# Altium project Qaud FC V10.6.PrjPcb
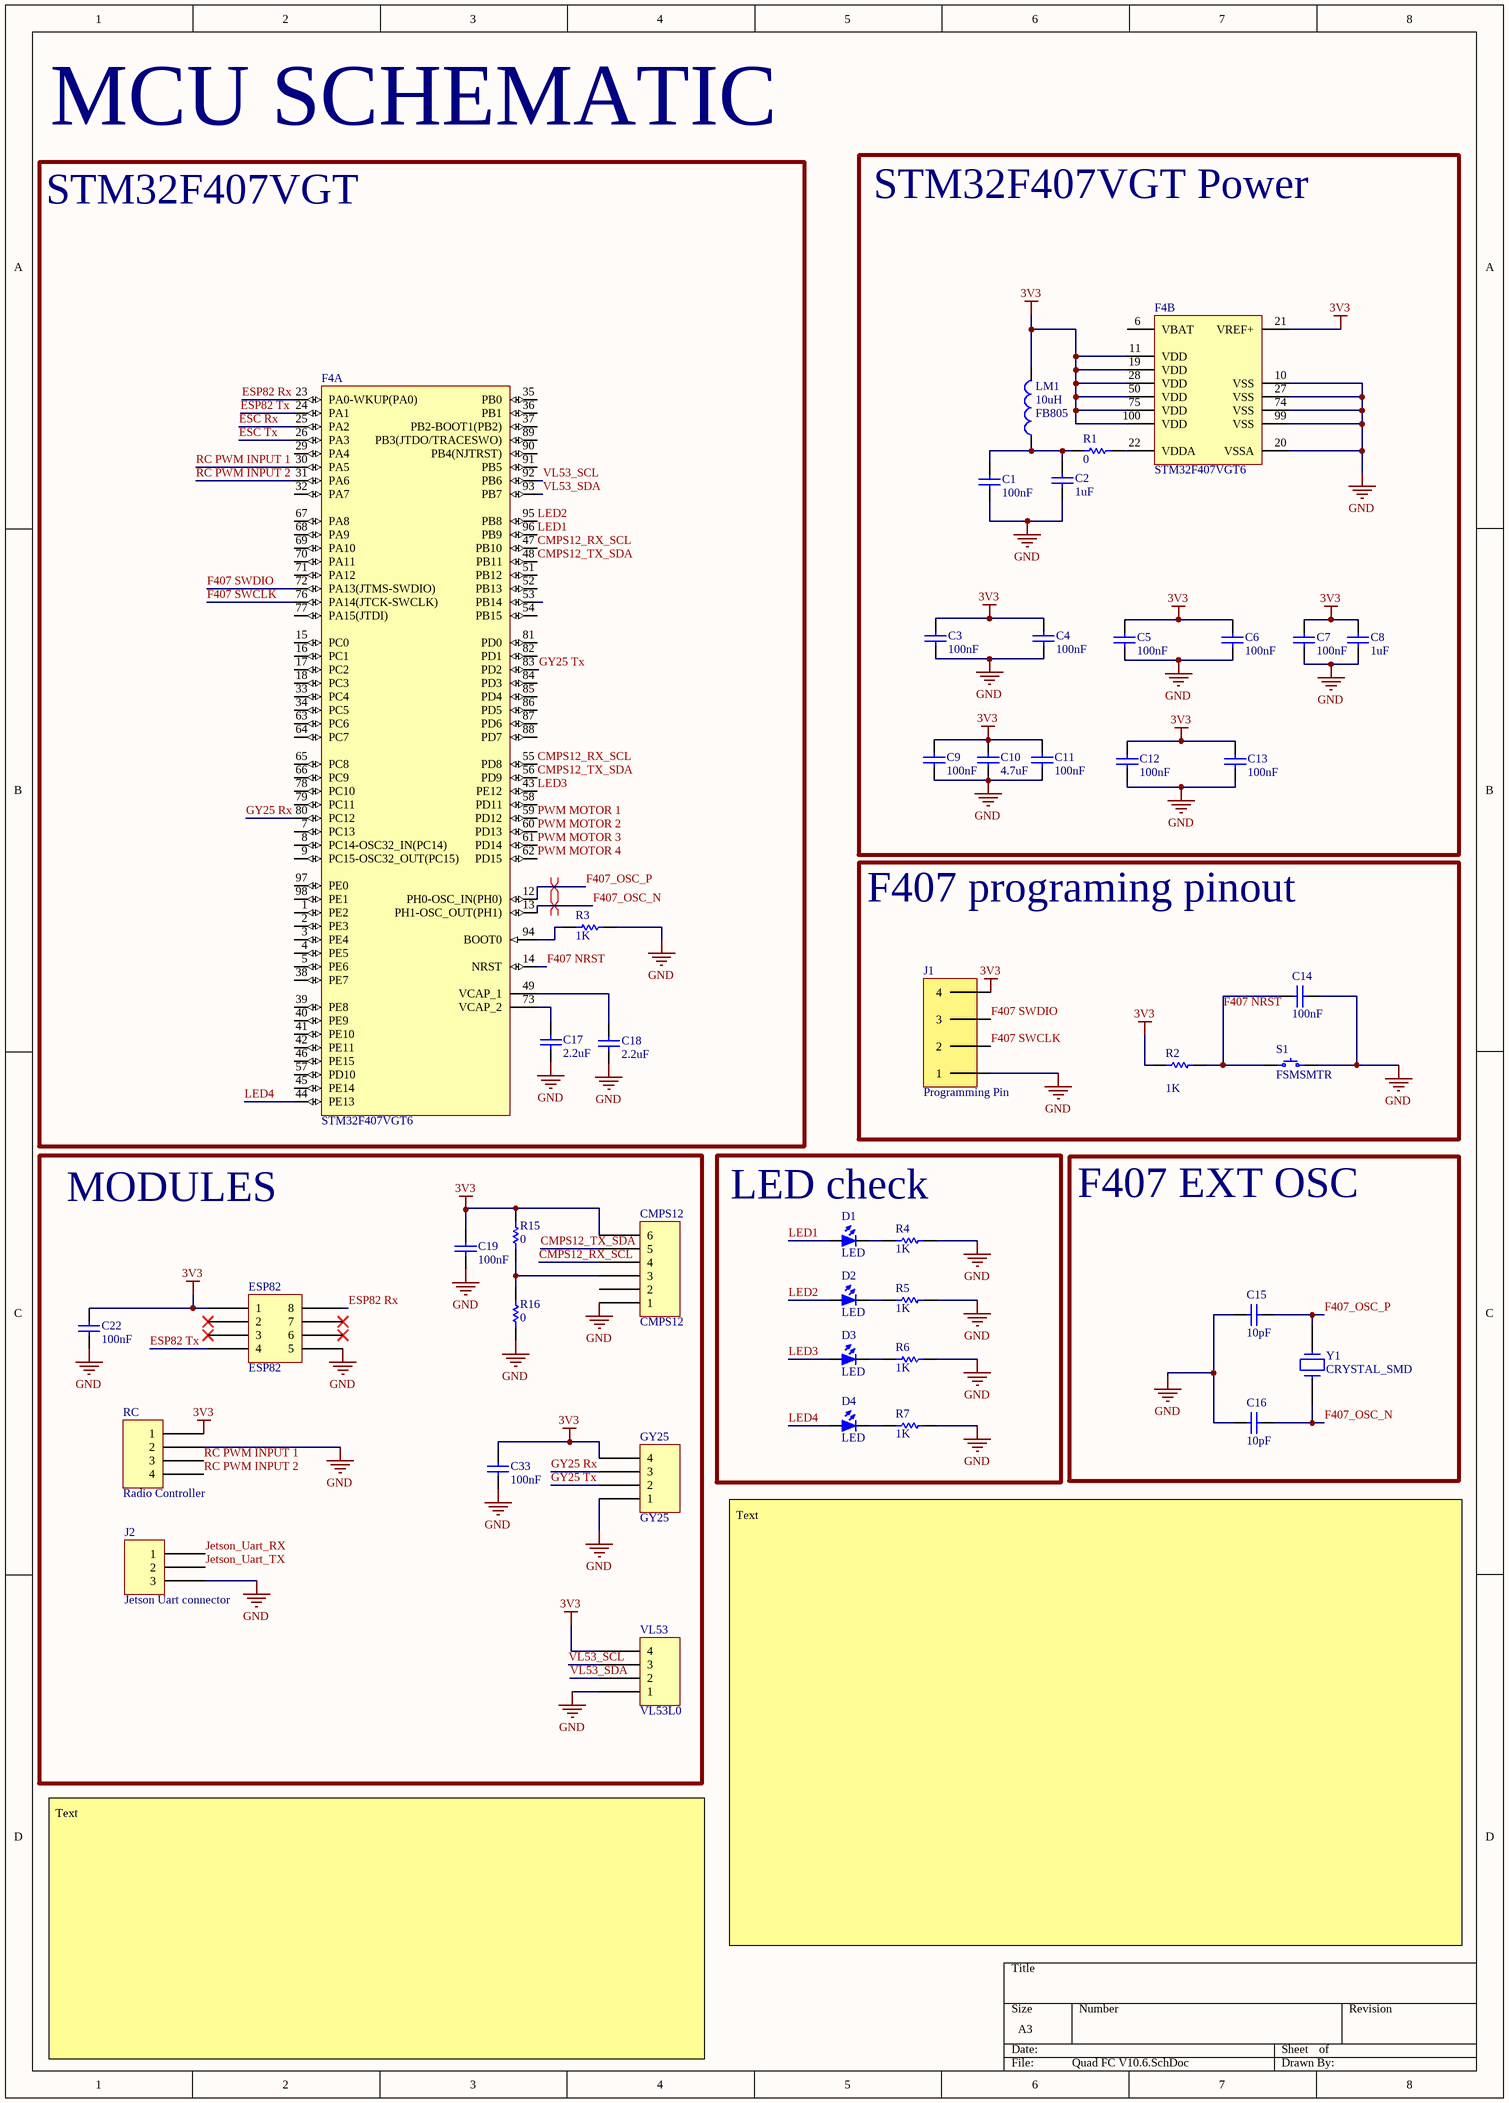
[diagram p0: Quad FC V10.6.SchDoc]
2 sheets, 70 parts. Net scope: global (net labels, ports and power ports of the same name join across sheets).
Board files: Quad FC 10.6.7.PcbDoc, Quad FC V10.6.5.PcbDoc
Sheets:
  Quad FC V10.6.SchDoc
  Quad FC power V10.6.SchDoc

## Sheet Quad FC V10.6.SchDoc
size A3 portrait; SheetNumber: 1; SheetTotal: 2

### Parts
C1  100nF  [CAP0603]
C2  1uF  [CAP0603]
C3  100nF  [CAP0603]
C4  100nF  [CAP0603]
C5  100nF  [CAP0603]
C6  100nF  [CAP0603]
C7  100nF  [CAP0603]
C8  1uF  [CAP0603]
C9  100nF  [CAP0603]
C10  4.7uF  [CAP0603]
C11  100nF  [CAP0603]
C12  100nF  [CAP0603]
C13  100nF  [CAP0603]
C14  100nF  [CAP0603]
C15  10pF  [CAP0603]
C16  10pF  [CAP0603]
C17  2.2uF  [CAP0603]
C18  2.2uF  [CAP0603]
C19  100nF  [CAP0603]
C22  100nF  [CAP0603]
C33  100nF  [CAP0603]
CMPS12  CMPS12  [SAMTEC SSW-106-03-T-S]
D1  LED  [0603 - LED]
D2  LED  [0603 - LED]
D3  LED  [0603 - LED]
D4  LED  [0603 - LED]
ESP82  ESP82  [HARWIN M20-7830445]
F4  STM32F407VGT6  [STM-LQFP100_N]  (parts A,B of 2)
GY25  GY25  [SAMTEC SSW-104-03-T-S]
J1  Programming Pin  [HEADER 4X1]
J2  Jetson Uart connector  [JST XH B3B-XH-A]
LM1  10uH  value FB805  [0805L]
R1  0  [RES0603]
R2  1K  [RES0603]
R3  1K  [RES0603]
R4  1K  [RES0603]
R5  1K  [RES0603]
R6  1K  [RES0603]
R7  1K  [RES0603]
R15  0  [RES0603]
R16  0  [RES0603]
RC  Radio Controller  [JST SM04B-GHS-TB]
S1  FSMSMTR  [TE FSMSMTR]
VL53  VL53L0  [JST SM04B-GHS-TB]
Y1  CRYSTAL_SMD  [My_Crystal - SMD]

### Blocks framed on the sheet
MCU SCHEMATIC: C17 C18 F4 R3
STM32F407VGT Power: C1-C13 F4 LM1 R1
F407 programing pinout: C14 J1 R2 S1
MODULES: C19 C22 C33 CMPS12 ESP82 GY25 J2 R15 R16 RC VL53
LED check: D1-D4 R4-R7
F407 EXT OSC: C15 C16 Y1

### Nets
3V3: C3.2 C4.2 C5.2 C6.2 C7.1 C8.1 C9.2 C10.2 C11.2 C12.2 C13.2 C19.1 C22.1 C33.1 CMPS12.6 ESP82.1 F4.11(VDD) F4.19(VDD) F4.21(VREF+) F4.28(VDD) F4.50(VDD) F4.75(VDD) F4.100(VDD) GY25.4 J1.4 LM1.2 R2.1 R15.2 RC.1 VL53.4
GND: C1.1 C2.1 C3.1 C4.1 C5.1 C6.1 C7.2 C8.2 C9.1 C10.1 C11.1 C12.1 C13.1 C14.2 C15.1 C16.2 C17.2 C18.2 C19.2 C22.2 C33.2 CMPS12.1 ESP82.5 F4.10(VSS) F4.20(VSSA) F4.27(VSS) F4.74(VSS) F4.99(VSS) GY25.1 J1.1 J2.3 R3.2 R4.2 R5.2 R6.2 R7.2 R16.1 RC.2 S1.2 VL53.1
CMPS12_RX_SCL: CMPS12.4 F4.47(PB10) F4.55(PD8)
CMPS12_TX_SDA: CMPS12.5 F4.48(PB11) F4.56(PD9)
ESC Rx: F4.25(PA2)
ESC Tx: F4.26(PA3)
ESP82 Rx: ESP82.8 F4.23(PA0-WKUP(PA0))
ESP82 Tx: ESP82.4 F4.24(PA1)
F407 NRST: C14.1 F4.14(NRST) R2.2 S1.1
F407 SWCLK: F4.76(PA14(JTCK-SWCLK)) J1.2
F407 SWDIO: F4.72(PA13(JTMS-SWDIO)) J1.3
F407_OSC_N: C16.1 F4.13(PH1-OSC_OUT(PH1)) Y1.1
F407_OSC_P: C15.2 F4.12(PH0-OSC_IN(PH0)) Y1.2
GY25 Rx: F4.80(PC12) GY25.3
GY25 Tx: F4.83(PD2) GY25.2
Jetson_Uart_RX: J2.1
Jetson_Uart_TX: J2.2
LED1: D1.1(A) F4.96(PB9)
LED2: D2.1(A) F4.95(PB8)
LED3: D3.1(A) F4.43(PE12)
LED4: D4.1(A) F4.44(PE13)
PWM MOTOR 1: F4.59(PD12)
PWM MOTOR 2: F4.60(PD13)
PWM MOTOR 3: F4.61(PD14)
PWM MOTOR 4: F4.62(PD15)
RC PWM INPUT 1: F4.30(PA5) RC.3
RC PWM INPUT 2: F4.31(PA6) RC.4
VL53_SCL: F4.92(PB6) VL53.3
VL53_SDA: F4.93(PB7) VL53.2
NetC1_2: C1.2 C2.2 LM1.1 R1.1
NetC17_1: C17.1 F4.73(VCAP_2)
NetC18_1: C18.1 F4.49(VCAP_1)
NetCMPS12_3: CMPS12.3 R15.1 R16.2
NetD1_2: D1.2(K) R4.1
NetD2_2: D2.2(K) R5.1
NetD3_2: D3.2(K) R6.1
NetD4_2: D4.2(K) R7.1
NetF4_22: F4.22(VDDA) R1.2
NetF4_94: F4.94(BOOT0) R3.1

Not connected (* = marked no-connect by the designer): CMPS12 2; ESP82 2* 3* 6* 7*; F4 1(PE2) 2(PE3) 3(PE4) 4(PE5) 5(PE6) 6(VBAT) 7(PC13) 8(PC14-OSC32_IN(PC14)) 9(PC15-OSC32_OUT(PC15)) 15(PC0) 16(PC1) 17(PC2) 18(PC3) 29(PA4) 32(PA7) 33(PC4) 34(PC5) 35(PB0) 36(PB1) 37(PB2-BOOT1(PB2)) 38(PE7) 39(PE8) 40(PE9) 41(PE10) 42(PE11) 45(PE14) 46(PE15) 51(PB12) 52(PB13) 53(PB14) 54(PB15) 57(PD10) 58(PD11) 63(PC6) 64(PC7) 65(PC8) 66(PC9) 67(PA8) 68(PA9) 69(PA10) 70(PA11) 71(PA12) 77(PA15(JTDI)) 78(PC10) 79(PC11) 81(PD0) 82(PD1) 84(PD3) 85(PD4) 86(PD5) 87(PD6) 88(PD7) 89(PB3(JTDO/TRACESWO)) 90(PB4(NJTRST)) 91(PB5) 97(PE0) 98(PE1)

### Layout directives
differential pair: F407_OSC_N, F407_OSC_P

### Notes on the sheet
- STM32F407VGT
- Text

### Library data of the parts
C1-C19 C22 C33 = CAP SMD PACKAGE: F407VET6 Power CAP; Designer: Abbas Basereh; Desc.: CAP SMD TOTAL PACKAGES; Data: 2017-3-10
CMPS12 = SSW-106-03-T-S: CONN RCPT 6POS 0.1 TIN PCB; Manufacturer: Samtec Inc.; Connector Type: Receptacle; Contact Length - Post: 0.394" (10.00mm); Current Rating (Amps): 5.7A per Contact; Material Flammability Rating: UL94 V-0; Number of Positions: 6; Number of Positions Loaded: All; Pitch - Mating: 0.100" (2.54mm); Style: Board to Board or Cable; Part Number: SSW-106-03-T-S; ComponentLink1Description: Datasheet; ComponentLink1URL: http://suddendocs.samtec.com/prints/ssw-s.pdf; ComponentLink2Description: DigiKey Link; ComponentLink2URL: https://www.digikey.com/en/products/detail/samtec-inc/SSW-106-03-T-S/1790202; Contact Finish - Mating: Tin; Contact Finish - Post: Tin; Contact Type: Forked; Fastening Type: Push-Pull; Insulation Color: Black; Insulation Height: 0.335" (8.51mm); LastUpdated: 6/21/2022 3:09:22 PM; Lifecycle Status: Active; Minimum Order: 1; Mounting Type: Through Hole; Number of Rows: 1; Operating Temperature: -55°C ~ 105°C; Packaging: Bulk; Part Status: Active; Price: 0.55; Series: SSW; Supplier 1: DigiKey; Supplier Part Number 1: SAM8865-ND; Termination: Solder
ESP82 = M20-7830442: CONN RCPT 8POS 0.1 GOLD PCB; Manufacturer: Harwin Inc.; Connector Type: Receptacle; Contact Length - Post: 0.118" (3.00mm); Current Rating (Amps): 3A; Mated Stacking Heights: 11.04mm, 12.63mm; Material Flammability Rating: UL94 V-0; Number of Positions: 8; Number of Positions Loaded: All; Pitch - Mating: 0.100" (2.54mm); Style: Board to Board or Cable; Part Number: M20-7830442; ComponentLink1Description: Datasheet; ComponentLink1URL: https://cdn.harwin.com/pdfs/C001XX_M20_Series_Connectors.pdf; ComponentLink2Description: DigiKey Link; ComponentLink2URL: http://digikey.com/product-detail/en/harwin-inc/M20-7830442/952-1789-ND/3727758; Contact Finish - Mating: Gold; Contact Finish - Post: Tin; Contact Finish Thickness - Mating: Flash; Contact Type: Female Socket; Fastening Type: Push-Pull; Insulation Color: Black; Insulation Height: 0.335" (8.51mm); LastUpdated: 9/21/2022 7:04:26 PM; Lifecycle Status: Active; Minimum Order: 1; Mounting Type: Through Hole; Number of Rows: 2; Operating Temperature: -40°C ~ 105°C; Packaging: Tube; Part Status: Active; Price: 1.36; Row Spacing - Mating: 0.100" (2.54mm); Series: M20; Supplier 1: DigiKey; Supplier Part Number 1: 952-1789-ND; Termination: Solder
F4 = STM32F407VGT6: ARM Cortex-M4 32-bit MCU+FPU, 210 DMIPS, 1024 kB Flash, 192 kB Internal RAM, 82 I/Os, 100-pin LQFP, -40 to 85 degC, Tray; Manufacturer: STMicroelectronics; D/A Converter: 2x12-bit; FLASH Size (Prog) (kB): 1024; I/Os (High Current): 82; Internal RAM Size (kB): 192; Operating Frequency(F) (Processor speed) (MHz): 168; Supply Voltage(Vcc) max (V): 3.6; Supply Voltage(Vcc) min (V): 1.8; DatasheetVersion: Rev. 4; PackageVersion: Rev. 1, 06/2013; PackageReference: LQFP100; PackageDescription: 100-Pin Low Profile Quad Flat Package, 14 x 14 mm Body, 0.5 mm Pitch; Supplier 1: Digi-Key; Supplier Part Number 1: 497-11605-ND; Supplier 2: Farnell; Supplier Part Number 2: 2064368; Supplier 3: Newark; Supplier Part Number 3: 73T2333; Supplier 4: Mouser; Supplier Part Number 4: 511-STM32F407VGT6; Core: ARM Cortex-M4; Packing: Tray; Mounting Technology: Surface Mount; PartNumber: STM32F407VGT6; ComponentLink1Description: Manufacturer URL; ComponentLink1URL: http://www.st.com/web/en/home.html; ComponentLink2Description: Datasheet; ComponentLink2URL: http://www.st.com/st-web-ui/static/active/en/resource/technical/document/datasheet/DM00037051.pdf; ComponentLink3Description: Package Specification; ComponentLink3URL: http://www.st.com/st-web-ui/static/active/en/resource/technical/document/data_brief/DM00071938.pdf
GY25 = SSW-104-03-T-S: CONN RCPT 4POS 0.1 TIN PCB; Manufacturer: Samtec Inc.; Connector Type: Receptacle; Current Rating (Amps): 5.7A per Contact; Material Flammability Rating: UL94 V-0; Number of Positions: 4; Number of Positions Loaded: All; Style: Board to Board or Cable; Part Number: SSW-104-03-T-S; ComponentLink2Description: DigiKey Link; ComponentLink2URL: http://digikey.com/product-detail/en/samtec-inc/SSW-104-03-T-S/SSW-104-03-T-S-ND/7874034; Contact Finish - Mating: Tin; Contact Finish - Post: Tin; Contact Type: Forked; Fastening Type: Push-Pull; Insulation Color: Black; LastUpdated: 6/21/2022 3:08:52 PM; Lifecycle Status: Active; Minimum Order: 1; Mounting Type: Through Hole; Number of Rows: 1; Operating Temperature: -55°C ~ 105°C; Packaging: Bulk; Part Status: Active; Price: 0.83; Series: SSW; Supplier 1: DigiKey; Supplier Part Number 1: SSW-104-03-T-S-ND; Termination: Solder
J1 = Header4X1
J2 = B3B-XH-A(LF)(SN): CONN HEADER VERT 3POS 2.5MM; Manufacturer: JST Sales America Inc.; Contact Length - Post: 0.134" (3.40mm); Current Rating (Amps): 3A; Material Flammability Rating: UL94 V-0; Number of Positions: 3; Number of Positions Loaded: All; Pitch - Mating: 0.098" (2.50mm); Shrouding: Shrouded - 4 Wall; Style: Board to Cable/Wire; Voltage Rating: 250V; Part Number: B3B-XH-A(LF)(SN); ComponentLink1Description: Datasheet; ComponentLink1URL: http://www.jst-mfg.com/product/pdf/eng/eXH.pdf; ComponentLink2Description: DigiKey Link; ComponentLink2URL: http://digikey.com/product-detail/en/jst-sales-america-inc/B3B-XH-A-LF-SN/455-2248-ND/1651046; Connector Type: Header; Contact Finish - Mating: Tin; Contact Finish - Post: Tin; Contact Material: Brass; Contact Shape: Square; Contact Type: Male Pin; Fastening Type: Detent Lock; Insulation Color: Natural; Insulation Height: 0.276" (7.00mm); Insulation Material: Polyamide (PA66), Nylon 6/6; LastUpdated: 1/12/2020 11:46:22 PM; Lifecycle Status: Active; Minimum Order: 1; Mounting Type: Through Hole; Number of Rows: 1; Operating Temperature: -25°C ~ 85°C; Packaging: Bulk; PartId: 68; Part Status: Active; Price: 0.19; Series: XH; Supplier 1: DigiKey; Supplier Part Number 1: 455-2248-ND; Termination: Press-Fit, Solder
LM1 = L SMA 0.25W: Inductor; Code_IEC: 1005; Published: 8-Jun-2000; LatestRevisionDate: 29-May-2009; LatestRevisionNote: IPC-7351 Footprint Added.; PackageReference: 0402-A; Publisher: Altium Limited; PackageDescription: Chip Inductor; Code_JEITA: 0402
R1-R7 R15 R16 = RES SMD PACKAGE: TOTAL SMD RESISTOR PACK; Designer: Abbas Basereh; Desc.: RES SMD PAKAGES; Data: 2017-3-10
  R1 R15 R16: VALUE: 0
  R2-R7: VALUE: 1K
RC VL53 = SM04B-GHS-TB(LF)(SN)-: CONN HEADER SMD R/A 4POS 1.25MM; Manufacturer: JST Sales America Inc.; Current Rating (Amps): 1A; Material Flammability Rating: UL94 V-0; Number of Positions: 4; Number of Positions Loaded: All; Pitch - Mating: 0.049" (1.25mm); Shrouding: Shrouded - 4 Wall; Style: Board to Cable/Wire; Voltage Rating: 50V; Part Number: SM04B-GHS-TB(LF)(SN)-; ComponentLink1Description: Datasheet; ComponentLink1URL: http://www.jst-mfg.com/product/pdf/eng/eGH.pdf; ComponentLink2Description: DigiKey Link; ComponentLink2URL: http://digikey.com/product-detail/en/jst-sales-america-inc/SM04B-GHS-TB-LF-SN/455-1566-1-ND/807834; Connector Type: Header; Contact Finish - Mating: Tin; Contact Finish - Post: Tin; Contact Material: Phosphor Bronze; Contact Shape: Rectangular; Contact Type: Outer Shroud Contact; Fastening Type: Locking Ramp; Features: Solder Retention; Insulation Color: Natural; Insulation Height: 0.167" (4.25mm); Insulation Material: Polyamide (PA9T), Nylon 9T; LastUpdated: 1/12/2020 11:37:43 PM; Lifecycle Status: Active; Minimum Order: 1; Mounting Type: Surface Mount, Right Angle; Number of Rows: 1; Operating Temperature: -25°C ~ 85°C; Packaging: TapeAndReel; PartId: 55; Part Status: Active; Price: 0.21; Series: GH; Supplier 1: DigiKey; Supplier Part Number 1: 455-1566-1-ND; Termination: Solder
S1 = FSMSMTR: SWITCH TACTILE SPST-NO 0.05A 24V; Manufacturer: TE Connectivity ALCOSWITCH Switches; Actuator Height off PCB, Vertical: 4.57mm; Actuator Orientation: Top Actuated; Actuator Type: Standard; Contact Rating @ Voltage: 0.05A @ 24VDC; Illumination: Non-Illuminated; Operating Force: 180gf; Outline: 6.00mm x 3.50mm; Switch Function: Off-Mom; Part Number: FSMSMTR; Circuit: SPST-NO; ComponentLink1Description: Datasheet; ComponentLink1URL: https://www.te.com/commerce/DocumentDelivery/DDEController?Action=srchrtrv&DocNm=1437566-3&DocType=Customer+Drawing&DocLang=English; ComponentLink2Description: DigiKey Link; ComponentLink2URL: https://www.digikey.com/en/products/detail/te-connectivity-alcoswitch-switches/FSMSMTR/529671; LastUpdated: 2/8/2024 9:49:52 PM; Lifecycle Status: Active; Minimum Order: 1; Mounting Type: Surface Mount; Operating Temperature: -35°C ~ 85°C; Packaging: TapeAndReel; Part Status: Active; Price: 0.20; Series: FSMSM; Supplier 1: DigiKey; Supplier Part Number 1: 450-1758-1-ND; Termination Style: Gull Wing
Y1 = CRYSTAL_SMD: Crystal
D1-D4 = LED: Published: 8-Jun-2000; LatestRevisionDate: 08-Jul-2005; LatestRevisionNote: Mech Layer 1 removed.; PackageReference: LED-0; Publisher: Altium Limited

## Sheet Quad FC power V10.6.SchDoc
size A4; SheetNumber: 2; SheetTotal: 2
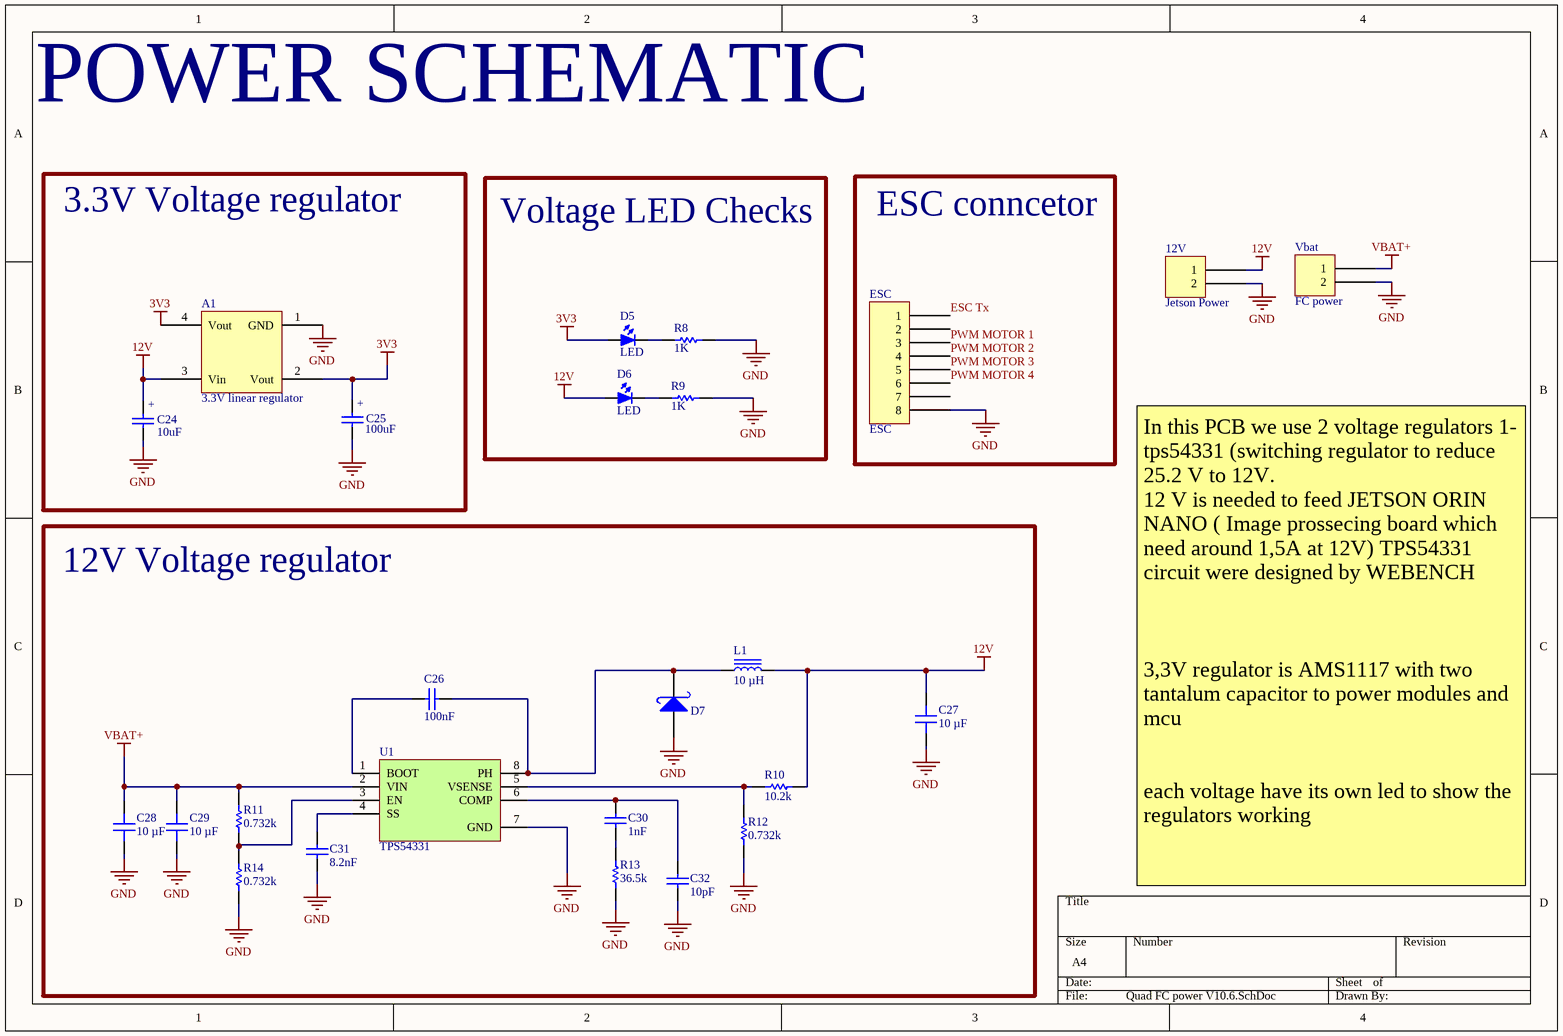
[diagram p1: Quad FC power V10.6.SchDoc]

### Parts
12V  Jetson Power  [JST XH B2B-XH-A]
A1  3.3V linear regulator  [SOT230P700X180-4N]
C24  10uF  [MY_CAP_SMD-B]
C25  100uF  [MY_CAP_SMD-B]
C26  100nF  [CAP0603]
C27  10 µF  [CAP 0805_2012]
C28  10 µF  [CAP 0805_2012]
C29  10 µF  [CAP 0805_2012]
C30  1nF  [CAP0603]
C31  8.2nF  [CAP0603]
C32  10pF  [CAP0603]
D5  LED  [0603 - LED]
D6  LED  [0603 - LED]
D7  1n5822  [DIOM4226X244N]  (value not drawn)
ESC  ESC  [JST BM08B-SRSS-TB]
L1  10 µH  [TAIYO YUDEN NRS8030]
R8  1K  [RES0603]
R9  1K  [RES0603]
R10  10.2k  [RES0603]
R11  0.732k  [RES0603]
R12  0.732k  [RES0603]
R13  36.5K  [RES0603]
R14  0.732k  [RES0603]
U1  TPS54331  [SO8]
Vbat  FC power  [JST XH B2B-XH-A]

### Blocks framed on the sheet
3.3V Voltage regulator: A1 C24 C25
Voltage LED Checks: D5 D6 R8 R9
ESC conncetor: ESC
12V Voltage regulator: C26-C32 D7 L1 R10-R14 U1

### Nets
3V3: A1.2(Vout) A1.4(Vout) C25.+ D5.1(A)
12V: 12V.1 A1.3(Vin) C24.+ C27.2 D6.1(A) L1.2 R10.2
GND: 12V.2 A1.1(GND) C24.- C25.- C27.1 C28.1 C29.1 C31.2 C32.2 D7.1(A) ESC.8 R8.2 R9.2 R12.1 R13.1 R14.1 U1.7(GND) Vbat.2
VBAT+: C28.2 C29.2 R11.2 U1.2(VIN) Vbat.1
ESC Tx: ESC.1
PWM MOTOR 1: ESC.3
PWM MOTOR 2: ESC.4
PWM MOTOR 3: ESC.5
PWM MOTOR 4: ESC.6
NetC26_1: C26.1 D7.2(K) L1.1 U1.8(PH)
NetC26_2: C26.2 U1.1(BOOT)
NetC30_1: C30.1 C32.1 U1.6(COMP)
NetC30_2: C30.2 R13.2
NetC31_1: C31.1 U1.4(SS)
NetD5_2: D5.2(K) R8.1
NetD6_2: D6.2(K) R9.1
NetR10_1: R10.1 R12.2 U1.5(VSENSE)
NetR11_1: R11.1 R14.2 U1.3(EN)

Not connected (* = marked no-connect by the designer): ESC 2 7

### Notes on the sheet
- POWER SCHEMATIC
- In this PCB we use 2 voltage regulators 1- tps54331 (switching regulator to reduce 25.2 V to 12V.
  12 V is needed to feed JETSON ORIN NANO ( Image prossecing board which need around 1,5A at 12V) TPS54331 circuit were designed by WEBENCH
  3,3V regulator is AMS1117 with two tantalum capacitor to power modules and mcu
  each voltage have its own led to show the regulators working

### Library data of the parts
12V Vbat = B2B-XH-A(LF)(SN): CONN HEADER VERT 2POS 2.5MM; Manufacturer: JST Sales America Inc.; Contact Length - Post: 0.134" (3.40mm); Current Rating (Amps): 3A; Material Flammability Rating: UL94 V-0; Number of Positions: 2; Number of Positions Loaded: All; Pitch - Mating: 0.098" (2.50mm); Shrouding: Shrouded - 4 Wall; Style: Board to Cable/Wire; Voltage Rating: 250V; Part Number: B2B-XH-A(LF)(SN); ComponentLink1Description: Datasheet; ComponentLink1URL: http://www.jst-mfg.com/product/pdf/eng/eXH.pdf; ComponentLink2Description: DigiKey Link; ComponentLink2URL: http://digikey.com/product-detail/en/jst-sales-america-inc/B2B-XH-A-LF-SN/455-2247-ND/1651045; Connector Type: Header; Contact Finish - Mating: Tin; Contact Finish - Post: Tin; Contact Material: Brass; Contact Shape: Square; Contact Type: Male Pin; Fastening Type: Detent Lock; Insulation Color: Natural; Insulation Height: 0.276" (7.00mm); Insulation Material: Polyamide (PA66), Nylon 6/6; LastUpdated: 1/12/2020 11:46:08 PM; Lifecycle Status: Active; Minimum Order: 1; Mounting Type: Through Hole; Number of Rows: 1; Operating Temperature: -25°C ~ 85°C; Packaging: Bulk; PartId: 67; Part Status: Active; Price: 0.15; Series: XH; Supplier 1: DigiKey; Supplier Part Number 1: 455-2247-ND; Termination: Press-Fit, Solder
A1 = ams1117
C24 C25 = CAP_TANTAL_B: 3.5X2.8MM; Value: 3300u
C26 C30-C32 = CAP SMD PACKAGE: as C1 on sheet Quad FC V10.6; Data: 2017-3-10
C27-C29 = GRM21BR61H106KE43K: CAP CER 10UF 50V X5R 0805; manufacturer: Murata Electronics; Tolerance: ±10%; Part Number: GRM21BR61H106KE43K; Value: 10 µF; Applications: General Purpose; Capacitance: 10 µF; componentlink1description: Datasheet; componentlink1url: https://search.murata.co.jp/Ceramy/image/img/A01X/G101/ENG/GRM21BR61H106KE43-01A.pdf; componentlink2description: DigiKey Link; componentlink2url: https://www.digikey.com/en/products/detail/murata-electronics/GRM21BR61H106KE43K/15191954; Device Package: 0805 (2012 Metric); lastupdated: 2/9/2024 8:15:01 PM; Lifecycle Status: Active; Minimum Order: 1; Mounting Type: Surface Mount, MLCC; Operating Temperature: -55°C ~ 85°C; Package / Case: 0805 (2012 Metric); packaging: TapeAndReel; partid: 40508; Part Status: Active; price: 0.05; series: GRM; Size / Dimension: 0.079" L x 0.049" W (2.00mm x 1.25mm); Supplier 1: DigiKey; Supplier Part Number 1: 490-GRM21BR61H106KE43KCT-ND; Temperature Coefficient: X5R; Thickness (Max): 0.057" (1.45mm); Voltage - Rated: 50V
D7 = 1n5822 SMD: Schottky Rectifiers; Part. No: SS34; Manufacturer: ON Semiconductor/Fairchild; Designer: Abbas Basereh; Link: https://www.aliexpress.com/item/Free-shipping-100pcs-1n5822-sma-smd-do-214ac-Schottky-diode-ss34/32337482329.html?spm=2114.01010208.3.1.zLZDsP&ws_ab_test=searchweb0_0,searchweb201602_4_10065_10068_10084_10083_10080_10082_10081_10060_10061_10062_10056_10055_10054_10059_10099_10078_10079_427_10073_10103_10102_10096_10052_10050_10051,searchweb201603_4&btsid=6e50dc92-ac69-45bc-a19e-209af19ce602; Link: http://www.tme.eu/en/details/ss34/smd-schottky-diodes/vishay/ss34-e357t/; Link: http://www.digikey.com/product-detail/en/on-semiconductor-fairchild/SS34/SS34FSCT-ND/2094459; Data: 16-12-2016
ESC = BM08B-SRSS-TBT(LF)(SN): CONN HEADER SMD 8POS 1MM; Part Number: BM08B-SRSS-TBT(LF)(SN)
L1 = NRS8030T100MJGJV: FIXED IND 10UH 3A 42.9 MOHM SMD; Manufacturer: Taiyo Yuden; Current - Saturation: 2.4A; DC Resistance (DCR): 42.9mOhm Max; Frequency - Self Resonant: 27MHz; Inductance Frequency - Test: 100 kHz; Material - Core: Ferrite; Shielding: Shielded; Tolerance: ±20%; Type: Drum Core, Wirewound; Part Number: NRS8030T100MJGJV; ComponentLink1Description: Datasheet; ComponentLink1URL: https://ds.yuden.co.jp/TYCOMPAS/ut/detail?pn=NRS8030T100MJGJV  &u=M; ComponentLink2Description: DigiKey Link; ComponentLink2URL: https://www.digikey.com/en/products/detail/taiyo-yuden/NRS8030T100MJGJV/4693986; Current Rating (Amps): 3 A; Device Package: Nonstandard; Height - Seated (Max): 0.118" (3.00mm); Inductance: 10 µH; LastUpdated: 2/8/2024 9:55:48 PM; Lifecycle Status: Active; Minimum Order: 1; Mounting Type: Surface Mount; Operating Temperature: -40°C ~ 125°C; Package / Case: Nonstandard; Packaging: TapeAndReel; PartId: 5482; Part Status: Active; Price: 0.23; Ratings: AEC-Q200; Series: NR, S Type; Size / Dimension: 0.315" L x 0.315" W (8.00mm x 8.00mm); Supplier 1: DigiKey; Supplier Part Number 1: 587-3647-1-ND; Value: 10 µH
R8-R14 = RES SMD PACKAGE: as R1 on sheet Quad FC V10.6; Data: 2017-3-10
  R8 R9: VALUE: 1K
  R10: VALUE: 10.2k
  R11 R12 R14: VALUE: 0.732k
  R13: VALUE: 36.5k
U1 = TPS54331: DC/DC Switching Regulators 2A,28V,1MHz Step Down SWIFT DC/D;Output Voltage:0.8 V to 25 V; Link: http://javanelec.com/productsDetails.aspx?id=33786
D5 D6 = LED: Published: 8-Jun-2000; LatestRevisionDate: 08-Jul-2005; LatestRevisionNote: Mech Layer 1 removed.; PackageReference: LED-0; Publisher: Altium Limited

## Nets that join several sheets
3V3: Quad FC V10.6 (30 pins), Quad FC power V10.6 (A1.2 A1.4 C25.+ D5.1)
GND: Quad FC V10.6 (40 pins), Quad FC power V10.6 (18 pins)
ESC Tx: Quad FC V10.6 (F4.26), Quad FC power V10.6 (ESC.1)
PWM MOTOR 1: Quad FC V10.6 (F4.59), Quad FC power V10.6 (ESC.3)
PWM MOTOR 2: Quad FC V10.6 (F4.60), Quad FC power V10.6 (ESC.4)
PWM MOTOR 3: Quad FC V10.6 (F4.61), Quad FC power V10.6 (ESC.5)
PWM MOTOR 4: Quad FC V10.6 (F4.62), Quad FC power V10.6 (ESC.6)